# Altium project M3 ICE.PrjPcb
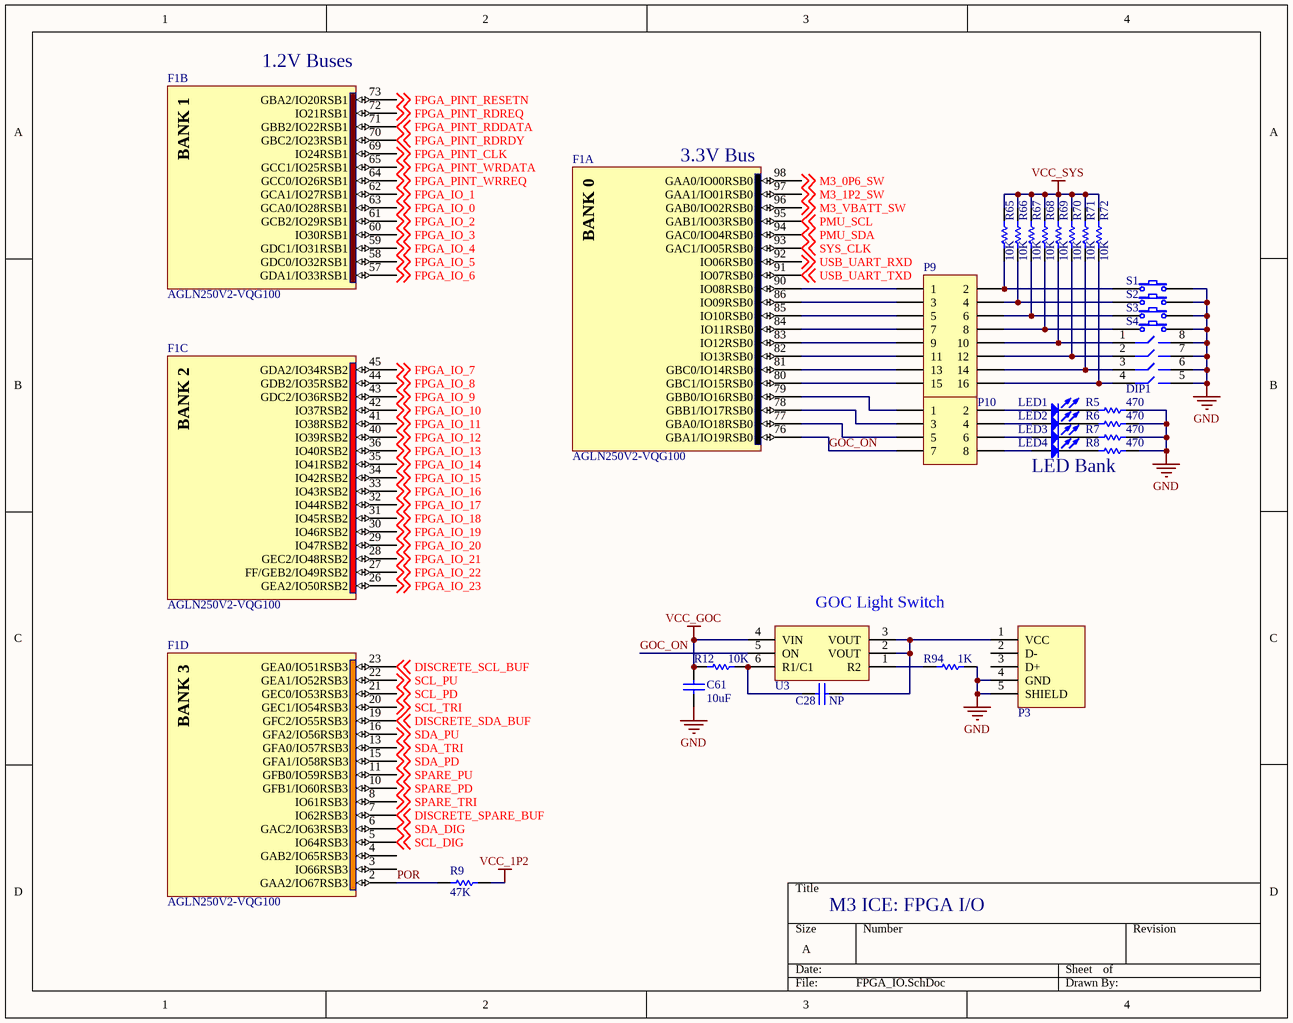
[diagram p0: FPGA_IO.SchDoc]
4 sheets, 185 parts. Net scope: global (net labels, ports and power ports of the same name join across sheets).
Board files: M3 ICE.PcbDoc, Drill Guide.PcbDoc
Sheets:
  FPGA_IO.SchDoc
  Power.SchDoc
  M3_Chip.SchDoc
  M3_Discrete_Interface.SchDoc

## Sheet FPGA_IO.SchDoc
size A

### Parts
C28  value NP  [0402]  (hidden comment: Cap Semi)
C61  value 10uF  [0805]  (hidden comment: Cap Chip)
DIP1  ADE0404  [DIP-8]  (value not drawn)
F1  AGLN250V2-VQG100  [VQ100_N]  (parts A,B,C,D of 8)
LED1  LED 1206  [1206_LED]  (value not drawn)
LED2  LED 1206  [1206_LED]  (value not drawn)
LED3  LED 1206  [1206_LED]  (value not drawn)
LED4  LED 1206  [1206_LED]  (value not drawn)
P3  USB_HORIZONTAL  [USB_HORIZONTAL]  (value not drawn)
P9  Header 8X2  [HDR2X8]  (value not drawn)
P10  Header 4X2  [HDR2X4]  (value not drawn)
R5  value 470  [0603]  (hidden comment: Res Chip)
R6  value 470  [0603]  (hidden comment: Res Chip)
R7  value 470  [0603]  (hidden comment: Res Chip)
R8  value 470  [0603]  (hidden comment: Res Chip)
R9  value 47K  [0603]  (hidden comment: Res Chip)
R12  value 10K  [0402]  (hidden comment: Res Chip)
R65  value 10K  [0603]  (hidden comment: Res Chip)
R66  value 10K  [0603]  (hidden comment: Res Chip)
R67  value 10K  [0603]  (hidden comment: Res Chip)
R68  value 10K  [0603]  (hidden comment: Res Chip)
R69  value 10K  [0603]  (hidden comment: Res Chip)
R70  value 10K  [0603]  (hidden comment: Res Chip)
R71  value 10K  [0603]  (hidden comment: Res Chip)
R72  value 10K  [0603]  (hidden comment: Res Chip)
R94  value 1K  [0402]  (hidden comment: Res Chip)
S1  EVQ-PAE04M  [EVQPA]  (value not drawn)
S2  EVQ-PAE04M  [EVQPA]  (value not drawn)
S3  EVQ-PAE04M  [EVQPA]  (value not drawn)
S4  EVQ-PAE04M  [EVQPA]  (value not drawn)
U3  FDC6330L  [SUPERSOT-6]  (value not drawn)

### Nets
GND: C61.2 DIP1.5 DIP1.6 DIP1.7 DIP1.8 P3.4(GND) P3.5(SHIELD) R5.1 R6.1 R7.1 R8.1 R94.2 S1.2 S2.2 S3.2 S4.2
VCC_1P2: R9.2
VCC_GOC: C61.1 R12.1 U3.4(VIN)
VCC_SYS: R65.1 R66.1 R67.1 R68.1 R69.1 R70.1 R71.1 R72.1
DISCRETE_SCL_BUF: F1.23(GEA0/IO51RSB3) ; off-sheet DISCRETE_SCL_BUF
DISCRETE_SDA_BUF: F1.19(GFC2/IO55RSB3) ; off-sheet DISCRETE_SDA_BUF
DISCRETE_SPARE_BUF: F1.7(IO62RSB3) ; off-sheet DISCRETE_SPARE_BUF
FPGA_IO_0: F1.63(GCA0/IO28RSB1) ; off-sheet FPGA_IO_0
FPGA_IO_1: F1.62(GCA1/IO27RSB1) ; off-sheet FPGA_IO_1
FPGA_IO_2: F1.61(GCB2/IO29RSB1) ; off-sheet FPGA_IO_2
FPGA_IO_3: F1.60(IO30RSB1) ; off-sheet FPGA_IO_3
FPGA_IO_4: F1.59(GDC1/IO31RSB1) ; off-sheet FPGA_IO_4
FPGA_IO_5: F1.58(GDC0/IO32RSB1) ; off-sheet FPGA_IO_5
FPGA_IO_6: F1.57(GDA1/IO33RSB1) ; off-sheet FPGA_IO_6
FPGA_IO_7: F1.45(GDA2/IO34RSB2) ; off-sheet FPGA_IO_7
FPGA_IO_8: F1.44(GDB2/IO35RSB2) ; off-sheet FPGA_IO_8
FPGA_IO_9: F1.43(GDC2/IO36RSB2) ; off-sheet FPGA_IO_9
FPGA_IO_10: F1.42(IO37RSB2) ; off-sheet FPGA_IO_10
FPGA_IO_11: F1.41(IO38RSB2) ; off-sheet FPGA_IO_11
FPGA_IO_12: F1.40(IO39RSB2) ; off-sheet FPGA_IO_12
FPGA_IO_13: F1.36(IO40RSB2) ; off-sheet FPGA_IO_13
FPGA_IO_14: F1.35(IO41RSB2) ; off-sheet FPGA_IO_14
FPGA_IO_15: F1.34(IO42RSB2) ; off-sheet FPGA_IO_15
FPGA_IO_16: F1.33(IO43RSB2) ; off-sheet FPGA_IO_16
FPGA_IO_17: F1.32(IO44RSB2) ; off-sheet FPGA_IO_17
FPGA_IO_18: F1.31(IO45RSB2) ; off-sheet FPGA_IO_18
FPGA_IO_19: F1.30(IO46RSB2) ; off-sheet FPGA_IO_19
FPGA_IO_20: F1.29(IO47RSB2) ; off-sheet FPGA_IO_20
FPGA_IO_21: F1.28(GEC2/IO48RSB2) ; off-sheet FPGA_IO_21
FPGA_IO_22: F1.27(FF/GEB2/IO49RSB2) ; off-sheet FPGA_IO_22
FPGA_IO_23: F1.26(GEA2/IO50RSB2) ; off-sheet FPGA_IO_23
FPGA_PINT_CLK: F1.69(IO24RSB1) ; off-sheet FPGA_PINT_CLK
FPGA_PINT_RDDATA: F1.71(GBB2/IO22RSB1) ; off-sheet FPGA_PINT_RDDATA
FPGA_PINT_RDRDY: F1.70(GBC2/IO23RSB1) ; off-sheet FPGA_PINT_RDRDY
FPGA_PINT_RDREQ: F1.72(IO21RSB1) ; off-sheet FPGA_PINT_RDREQ
FPGA_PINT_RESETN: F1.73(GBA2/IO20RSB1) ; off-sheet FPGA_PINT_RESETN
FPGA_PINT_WRDATA: F1.65(GCC1/IO25RSB1) ; off-sheet FPGA_PINT_WRDATA
FPGA_PINT_WRREQ: F1.64(GCC0/IO26RSB1) ; off-sheet FPGA_PINT_WRREQ
GOC_ON: F1.76(GBA1/IO19RSB0) P10.7 U3.5(ON)
M3_0P6_SW: F1.98(GAA0/IO00RSB0) ; off-sheet M3_0P6_SW
M3_1P2_SW: F1.97(GAA1/IO01RSB0) ; off-sheet M3_1P2_SW
M3_VBATT_SW: F1.96(GAB0/IO02RSB0) ; off-sheet M3_VBATT_SW
PMU_SCL: F1.95(GAB1/IO03RSB0) ; off-sheet PMU_SCL
PMU_SDA: F1.94(GAC0/IO04RSB0) ; off-sheet PMU_SDA
POR: F1.2(GAA2/IO67RSB3) R9.1
SCL_DIG: F1.5(IO64RSB3) ; off-sheet SCL_DIG
SCL_PD: F1.21(GEC0/IO53RSB3) ; off-sheet SCL_PD
SCL_PU: F1.22(GEA1/IO52RSB3) ; off-sheet SCL_PU
SCL_TRI: F1.20(GEC1/IO54RSB3) ; off-sheet SCL_TRI
SDA_DIG: F1.6(GAC2/IO63RSB3) ; off-sheet SDA_DIG
SDA_PD: F1.15(GFA1/IO58RSB3) ; off-sheet SDA_PD
SDA_PU: F1.16(GFA2/IO56RSB3) ; off-sheet SDA_PU
SDA_TRI: F1.13(GFA0/IO57RSB3) ; off-sheet SDA_TRI
SPARE_PD: F1.10(GFB1/IO60RSB3) ; off-sheet SPARE_PD
SPARE_PU: F1.11(GFB0/IO59RSB3) ; off-sheet SPARE_PU
SPARE_TRI: F1.8(IO61RSB3) ; off-sheet SPARE_TRI
SYS_CLK: F1.93(GAC1/IO05RSB0) ; off-sheet SYS_CLK
USB_UART_RXD: F1.92(IO06RSB0) ; off-sheet USB_UART_RXD
USB_UART_TXD: F1.91(IO07RSB0) ; off-sheet USB_UART_TXD
NetC28_1: C28.1 P3.1(VCC) U3.2(VOUT) U3.3(VOUT)
NetC28_2: C28.2 R12.2 U3.6(R1/C1)
NetDIP1_1: DIP1.1 P9.10 R69.2
NetDIP1_2: DIP1.2 P9.12 R70.2
NetDIP1_3: DIP1.3 P9.14 R71.2
NetDIP1_4: DIP1.4 P9.16 R72.2
NetF1_77: F1.77(GBA0/IO18RSB0) P10.5
NetF1_78: F1.78(GBB1/IO17RSB0) P10.3
NetF1_79: F1.79(GBB0/IO16RSB0) P10.1
NetF1_80: F1.80(GBC1/IO15RSB0) P9.15
NetF1_81: F1.81(GBC0/IO14RSB0) P9.13
NetF1_82: F1.82(IO13RSB0) P9.11
NetF1_83: F1.83(IO12RSB0) P9.9
NetF1_84: F1.84(IO11RSB0) P9.7
NetF1_85: F1.85(IO10RSB0) P9.5
NetF1_86: F1.86(IO09RSB0) P9.3
NetF1_90: F1.90(IO08RSB0) P9.1
NetLED1_1: LED1.1(A) P10.2
NetLED1_2: LED1.2(K) R5.2
NetLED2_1: LED2.1(A) P10.4
NetLED2_2: LED2.2(K) R6.2
NetLED3_1: LED3.1(A) P10.6
NetLED3_2: LED3.2(K) R7.2
NetLED4_1: LED4.1(A) P10.8
NetLED4_2: LED4.2(K) R8.2
NetP9_2: P9.2 R65.2 S1.1
NetP9_4: P9.4 R66.2 S2.1
NetP9_6: P9.6 R67.2 S3.1
NetP9_8: P9.8 R68.2 S4.1
NetR94_1: R94.1 U3.1(R2)

Not connected (* = marked no-connect by the designer): F1 3(IO66RSB3) 4(GAB2/IO65RSB3); P3 2(D-) 3(D+)

### Notes on the sheet
- (near F1) 1.2V Buses
- (near F1) 3.3V Bus
- LED Bank
- (near U3) GOC Light Switch
- M3 ICE: FPGA I/O
- (in symbol AGLN250V2-VQG100, part A) BANK 0
- (in symbol AGLN250V2-VQG100, part B) BANK 1
- (in symbol AGLN250V2-VQG100, part C) BANK 2
- (in symbol AGLN250V2-VQG100, part D) BANK 3

### Library data of the parts
C28 = Cap Semi: Capacitor (Semiconductor SIM Model); Published: 8-Jun-2000; LatestRevisionDate: 29-May-2009; LatestRevisionNote: IPC-7351 Footprint Added.; PackageReference: C1206; Publisher: Altium Limited; PackageDescription: Chip Capacitor
C61 = Cap Chip: Capacitor (Semiconductor SIM Model); DistPartNo: 445-6857-1-ND; ManPartNo: C2012X7R1A106K; Published: 8-Jun-2000; LatestRevisionDate: 29-May-2009; LatestRevisionNote: IPC-7351 Footprint Added.; PackageReference: C1206; Publisher: Altium Limited; PackageDescription: Chip Capacitor
DIP1 = ADE0404: 4-DIP Switch; DistPartNo: 450-1364-ND; PackageReference: DIP-8; ManPartNo: ADE0404
F1 = AGLN250V2-VQG100: IGLOO nano Low-Power Flash 1.2 to 1.5V FPGA with Flash*Freeze, 68 User IOs, 250K System Gates, 1Kbit Flash ROM, 100-Pin TQFP, Commercial Grade, Pb-Free; DistPartNo: 1100-1134-ND; Published: 29-May-2009; DatasheetVersion: Feb-2009; PackageVersion: v11.0, Feb-2009; PackageReference: VQ100; Publisher: Altium Limited; PackageDescription: 100-Pin Plastic Quad Flat Pack (VQ100); Code_JEDEC: MS-026-AED; ComponentLink1Description: Manufacturer Link; ComponentLink1URL: http://www.actel.com/products/igloonano/default.aspx; ComponentLink2Description: Datasheet; ComponentLink2URL: http://www.actel.com/documents/IGLOO_nano_DS.pdf; ManPartNo: AGLN250V2-VQG100
LED1-LED4 = LED 1206: DistPartNo: 160-1169-1-ND; ManPartNo: LTST-C150GKT
P3 = USB_HORIZONTAL: DistPartNo: A31726-ND; ManPartNo: 292303-1
P9 = Header 8X2: Header, 8-Pin, Dual row; LatestRevisionDate: 17-Jul-2002; LatestRevisionNote: Re-released for DXP Platform.; Publisher: Altium Limited
P10 = Header 4X2: Header, 4-Pin, Dual row; LatestRevisionDate: 17-Jul-2002; LatestRevisionNote: Re-released for DXP Platform.; Publisher: Altium Limited
R5-R8 = Res Chip: Semiconductor Resistor; DistPartNo: P470GCT-ND; ManPartNo: ERJ-3GEYJ471V; Published: 8-Jun-2000; LatestRevisionDate: 17-Jul-2002; LatestRevisionNote: Re-released for DXP Platform.; PackageReference: AXIAL-0.5; Publisher: Altium Limited; PackageDescription: Axial Device, Thru-Hole; 2 Leads; 0.5 in Pin Spacing
R9 = Res Chip: Semiconductor Resistor; DistPartNo: P47KGCT-ND; ManPartNo: ERJ-3GEYJ103V; Published: 8-Jun-2000; LatestRevisionDate: 17-Jul-2002; LatestRevisionNote: Re-released for DXP Platform.; PackageReference: AXIAL-0.5; Publisher: Altium Limited; PackageDescription: Axial Device, Thru-Hole; 2 Leads; 0.5 in Pin Spacing
R12 = Res Chip: Semiconductor Resistor; ManPartNo: ERJ-2RKF1002X; DistPartNo: P10.0KLCT-ND; Published: 8-Jun-2000; LatestRevisionDate: 17-Jul-2002; LatestRevisionNote: Re-released for DXP Platform.; PackageReference: AXIAL-0.5; Publisher: Altium Limited; PackageDescription: Axial Device, Thru-Hole; 2 Leads; 0.5 in Pin Spacing
R65-R72 = Res Chip: Semiconductor Resistor; DistPartNo: P10KGCT-ND; ManPartNo: ERJ-3GEYJ103V; Published: 8-Jun-2000; LatestRevisionDate: 17-Jul-2002; LatestRevisionNote: Re-released for DXP Platform.; PackageReference: AXIAL-0.5; Publisher: Altium Limited; PackageDescription: Axial Device, Thru-Hole; 2 Leads; 0.5 in Pin Spacing
R94 = Res Chip: Semiconductor Resistor; ManPartNo: ERJ-2RKF1001X; DistPartNo: P1.00KLCT-ND; Published: 8-Jun-2000; LatestRevisionDate: 17-Jul-2002; LatestRevisionNote: Re-released for DXP Platform.; PackageReference: AXIAL-0.5; Publisher: Altium Limited; PackageDescription: Axial Device, Thru-Hole; 2 Leads; 0.5 in Pin Spacing
S1-S4 = EVQ-PAE04M: Switch Push; DistPartNo: P8008S-ND; ManPartNo: EVQ-PAE04M
U3 = FDC6330L: HS Switch; DistPartNo: FDC6330LCT-ND; ManPartNo: FDC6330L

## Sheet Power.SchDoc
size A
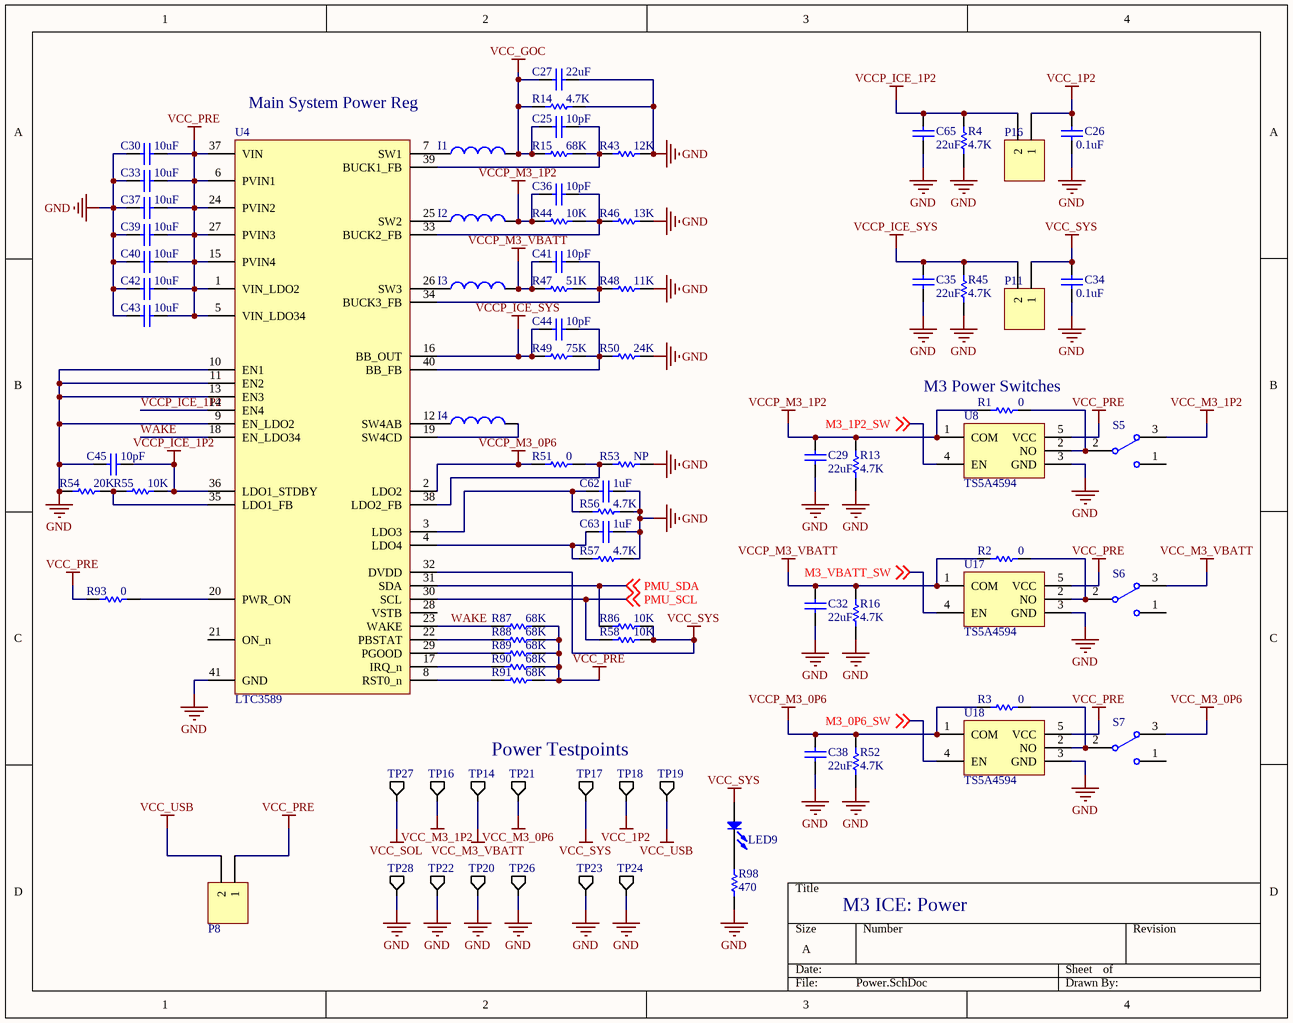
[diagram p1: Power.SchDoc]

### Parts
C25  value 10pF  [0402]  (hidden comment: Cap Semi)
C26  value 0.1uF  [1608[0603]]  (hidden comment: Cap Semi)
C27  value 22uF  [0805]  (hidden comment: Cap Chip)
C29  value 22uF  [0805]  (hidden comment: Cap Chip)
C30  value 10uF  [0805]  (hidden comment: Cap Chip)
C32  value 22uF  [0805]  (hidden comment: Cap Chip)
C33  value 10uF  [0805]  (hidden comment: Cap Chip)
C34  value 0.1uF  [1608[0603]]  (hidden comment: Cap Semi)
C35  value 22uF  [0805]  (hidden comment: Cap Chip)
C36  value 10pF  [0402]  (hidden comment: Cap Semi)
C37  value 10uF  [0805]  (hidden comment: Cap Chip)
C38  value 22uF  [0805]  (hidden comment: Cap Chip)
C39  value 10uF  [0805]  (hidden comment: Cap Chip)
C40  value 10uF  [0805]  (hidden comment: Cap Chip)
C41  value 10pF  [0402]  (hidden comment: Cap Semi)
C42  value 10uF  [0805]  (hidden comment: Cap Chip)
C43  value 10uF  [0805]  (hidden comment: Cap Chip)
C44  value 10pF  [0402]  (hidden comment: Cap Semi)
C45  value 10pF  [0402]  (hidden comment: Cap Semi)
C62  value 1uF  [0402]  (hidden comment: Cap Semi)
C63  value 1uF  [0402]  (hidden comment: Cap Semi)
C65  value 22uF  [0805]  (hidden comment: Cap Chip)
I1  NR5040T1R5N  [INDUCTOR_.118x.142mm]  (value not drawn)
I2  NR5040T1R5N  [INDUCTOR_.118x.142mm]  (value not drawn)
I3  NR5040T1R5N  [INDUCTOR_.118x.142mm]  (value not drawn)
I4  NR5040T1R5N  [INDUCTOR_.118x.142mm]  (value not drawn)
LED9  LED 1206  [1206_LED]  (value not drawn)
P8  Header 2  [HDR1X2]  (value not drawn)
P11  Header 2  [HDR1X2]  (value not drawn)
P16  Header 2  [HDR1X2]  (value not drawn)
R1  value 0  [0603]  (hidden comment: Res Chip)
R2  value 0  [0603]  (hidden comment: Res Chip)
R3  value 0  [0603]  (hidden comment: Res Chip)
R4  value 4.7K  [0603]  (hidden comment: Res Chip)
R13  value 4.7K  [0603]  (hidden comment: Res Chip)
R14  value 4.7K  [0603]  (hidden comment: Res Chip)
R15  value 68K  [0402]  (hidden comment: Res Chip)
R16  value 4.7K  [0603]  (hidden comment: Res Chip)
R43  value 12K  [0402]  (hidden comment: Res Chip)
R44  value 10K  [0402]  (hidden comment: Res Chip)
R45  value 4.7K  [0603]  (hidden comment: Res Chip)
R46  value 13K  [0402]  (hidden comment: Res Chip)
R47  value 51K  [0402]  (hidden comment: Res Chip)
R48  value 11K  [0402]  (hidden comment: Res Chip)
R49  value 75K  [0402]  (hidden comment: Res Chip)
R50  value 24K  [0402]  (hidden comment: Res Chip)
R51  value 0  [0402]  (hidden comment: Res Chip)
R52  value 4.7K  [0603]  (hidden comment: Res Chip)
R53  value NP  [0402]  (hidden comment: Res Chip)
R54  value 20K  [0402]  (hidden comment: Res Chip)
R55  value 10K  [0402]  (hidden comment: Res Chip)
R56  value 4.7K  [0402]  (hidden comment: Res Chip)
R57  value 4.7K  [0402]  (hidden comment: Res Chip)
R58  value 10K  [0402]  (hidden comment: Res Chip)
R86  value 10K  [0402]  (hidden comment: Res Chip)
R87  value 68K  [0402]  (hidden comment: Res Chip)
R88  value 68K  [0402]  (hidden comment: Res Chip)
R89  value 68K  [0402]  (hidden comment: Res Chip)
R90  value 68K  [0402]  (hidden comment: Res Chip)
R91  value 68K  [0402]  (hidden comment: Res Chip)
R93  value 0  [0402]  (hidden comment: Res Chip)
R98  value 470  [0603]  (hidden comment: Res Chip)
S5  OS102011MS2QN1  [SPDT_SW2]  (value not drawn)
S6  OS102011MS2QN1  [SPDT_SW2]  (value not drawn)
S7  OS102011MS2QN1  [SPDT_SW2]  (value not drawn)
TP14  TP  [TP]  (value not drawn)
TP16  TP  [TP]  (value not drawn)
TP17  TP  [TP]  (value not drawn)
TP18  TP  [TP]  (value not drawn)
TP19  TP  [TP]  (value not drawn)
TP20  TP  [TP]  (value not drawn)
TP21  TP  [TP]  (value not drawn)
TP22  TP  [TP]  (value not drawn)
TP23  TP  [TP]  (value not drawn)
TP24  TP  [TP]  (value not drawn)
TP26  TP  [TP]  (value not drawn)
TP27  TP  [TP]  (value not drawn)
TP28  TP  [TP]  (value not drawn)
U4  LTC3589  [QFN-40]
U8  TS5A4594  [SOT25]
U17  TS5A4594  [SOT25]
U18  TS5A4594  [SOT25]

### Nets
GND: C26.1 C27.1 C29.1 C30.2 C32.1 C33.2 C34.1 C35.1 C37.2 C38.1 C39.2 C40.2 C42.2 C43.2 C45.2 C62.1 C63.1 C65.2 R4.2 R13.1 R14.1 R16.1 R43.2 R45.1 R46.2 R48.2 R50.2 R52.1 R53.2 R54.1 R56.2 R57.2 R98.1 TP20.1(A) TP22.1(A) TP23.1(A) TP24.1(A) TP26.1(A) TP28.1(A) U4.9(EN_LDO2) U4.10(EN1) U4.11(EN2) U4.13(EN3) U4.41(GND) U8.3(GND) U17.3(GND) U18.3(GND)
VCC_1P2: C26.2 P16.1 TP18.1(A)
VCC_GOC: C25.2 C27.2 I1.2 R14.2 R15.1
VCC_M3_0P6: S7.3 TP21.1(A)
VCC_M3_1P2: S5.3 TP16.1(A)
VCC_M3_VBATT: S6.3 TP14.1(A)
VCC_PRE: C30.1 C33.1 C37.1 C39.1 C40.1 C42.1 C43.1 P8.1 R87.2 R88.2 R89.2 R90.2 R91.2 R93.1 U4.1(VIN_LDO2) U4.5(VIN_LDO34) U4.6(PVIN1) U4.15(PVIN4) U4.24(PVIN2) U4.27(PVIN3) U4.37(VIN) U8.5(VCC) U17.5(VCC) U18.5(VCC)
VCC_SOL: TP27.1(A)
VCC_SYS: C34.2 LED9.1(A) P11.1 R58.2 R86.2 TP17.1(A) U4.32(DVDD)
VCC_USB: P8.2 TP19.1(A)
VCCP_ICE_1P2: C45.1 C65.1 P16.2 R4.1 R55.2 U4.14(EN4) U4.36(LDO1_STDBY)
VCCP_ICE_SYS: C35.2 C44.2 P11.2 R45.2 R49.1 U4.16(BB_OUT)
VCCP_M3_0P6: C38.2 R3.2 R51.1 R52.2 U4.2(LDO2) U18.1(COM)
VCCP_M3_1P2: C29.2 C36.2 I2.2 R1.2 R13.2 R44.1 U8.1(COM)
VCCP_M3_VBATT: C32.2 C41.2 I3.2 R2.2 R16.2 R47.1 U17.1(COM)
M3_0P6_SW: U18.4(EN) ; off-sheet M3_0P6_SW
M3_1P2_SW: U8.4(EN) ; off-sheet M3_1P2_SW
M3_VBATT_SW: U17.4(EN) ; off-sheet M3_VBATT_SW
PMU_SCL: R58.1 U4.30(SCL) ; off-sheet PMU_SCL
PMU_SDA: R86.1 U4.31(SDA) ; off-sheet PMU_SDA
WAKE: R87.1 U4.18(EN_LDO34) U4.23(WAKE)
NetC25_1: C25.1 R15.2 R43.1 U4.39(BUCK1_FB)
NetC36_1: C36.1 R44.2 R46.1 U4.33(BUCK2_FB)
NetC41_1: C41.1 R47.2 R48.1 U4.34(BUCK3_FB)
NetC44_1: C44.1 R49.2 R50.1 U4.40(BB_FB)
NetC62_2: C62.2 R56.1 U4.3(LDO3)
NetC63_2: C63.2 R57.1 U4.4(LDO4)
NetI1_1: I1.1 U4.7(SW1)
NetI2_1: I2.1 U4.25(SW2)
NetI3_1: I3.1 U4.26(SW3)
NetI4_1: I4.1 U4.12(SW4AB)
NetI4_2: I4.2 U4.19(SW4CD)
NetLED9_2: LED9.2(K) R98.2
NetR1_1: R1.1 S5.2 U8.2(NO)
NetR2_1: R2.1 S6.2 U17.2(NO)
NetR3_1: R3.1 S7.2 U18.2(NO)
NetR51_2: R51.2 R53.1 U4.38(LDO2_FB)
NetR54_2: R54.2 R55.1 U4.35(LDO1_FB)
NetR88_1: R88.1 U4.22(PBSTAT)
NetR89_1: R89.1 U4.29(PGOOD)
NetR90_1: R90.1 U4.17(IRQ_n)
NetR91_1: R91.1 U4.8(RST0_n)
NetR93_2: R93.2 U4.20(PWR_ON)

Not connected (* = marked no-connect by the designer): S5 1; S6 1; S7 1; U4 21(ON_n) 28(VSTB)

### Notes on the sheet
- Main System Power Reg
- (near R1) M3 Power Switches
- Power Testpoints
- M3 ICE: Power

### Library data of the parts
C25 C36 C41 C44 C45 = Cap Semi: Capacitor (Semiconductor SIM Model); DistPartNo: 445-1235-1-ND; ManPartNo: C1005C0G1H100D; Published: 8-Jun-2000; LatestRevisionDate: 29-May-2009; LatestRevisionNote: IPC-7351 Footprint Added.; PackageReference: C1206; Publisher: Altium Limited; PackageDescription: Chip Capacitor
C26 C34 = Cap Semi: Capacitor (Semiconductor SIM Model); DistPartNo: 445-1317-1-ND; ManPartNo: C1608X7R1C104K; Published: 8-Jun-2000; LatestRevisionDate: 29-May-2009; LatestRevisionNote: IPC-7351 Footprint Added.; PackageReference: C1206; Publisher: Altium Limited; PackageDescription: Chip Capacitor
C27 C29 C32 C35 C38 C65 = Cap Chip: Capacitor (Semiconductor SIM Model); DistPartNo: 587-2782-1-ND; ManPartNo: LMK316AB7226ML-TR; Published: 8-Jun-2000; LatestRevisionDate: 29-May-2009; LatestRevisionNote: IPC-7351 Footprint Added.; PackageReference: C1206; Publisher: Altium Limited; PackageDescription: Chip Capacitor
C30 C33 C37 C39 C40 C42 C43 = Cap Chip: as C61 on sheet FPGA_IO; Published: 8-Jun-2000; LatestRevisionDate: 29-May-2009; LatestRevisionNote: IPC-7351 Footprint Added.; PackageReference: C1206; Publisher: Altium Limited; PackageDescription: Chip Capacitor
C62 C63 = Cap Semi: Capacitor (Semiconductor SIM Model); DistPartNo: 445-4991-1-ND; ManPartNo: C1005X5R1A105M; Published: 8-Jun-2000; LatestRevisionDate: 29-May-2009; LatestRevisionNote: IPC-7351 Footprint Added.; PackageReference: C1206; Publisher: Altium Limited; PackageDescription: Chip Capacitor
I1-I4 = IHLP1212: DistPartNo: 541-1327-1-ND; ManPartNo: IHLP1212AEER1R0M11
LED9 = LED 1206: as LED1 on sheet FPGA_IO
P8 P11 P16 = Header 2: Header, 2-Pin; LatestRevisionDate: 17-Jul-2002; LatestRevisionNote: Re-released for DXP Platform.; Publisher: Altium Limited
R1-R3 = Res Chip: Semiconductor Resistor; DistPartNo: P0.0GCT-ND; ManPartNo: ERJ-3GEY0R00V; Published: 8-Jun-2000; LatestRevisionDate: 17-Jul-2002; LatestRevisionNote: Re-released for DXP Platform.; PackageReference: AXIAL-0.5; Publisher: Altium Limited; PackageDescription: Axial Device, Thru-Hole; 2 Leads; 0.5 in Pin Spacing
R4 R13 R14 R16 R45 R52 = Res Chip: Semiconductor Resistor; DistPartNo: P4.7KGCT-ND; ManPartNo: ERJ-3GEYJ472V; Published: 8-Jun-2000; LatestRevisionDate: 17-Jul-2002; LatestRevisionNote: Re-released for DXP Platform.; PackageReference: AXIAL-0.5; Publisher: Altium Limited; PackageDescription: Axial Device, Thru-Hole; 2 Leads; 0.5 in Pin Spacing
R15 R87-R91 = Res Chip: Semiconductor Resistor; DistPartNo: P68.0KLCT-ND; ManPartNo: ERJ-2RKF6802X; Published: 8-Jun-2000; LatestRevisionDate: 17-Jul-2002; LatestRevisionNote: Re-released for DXP Platform.; PackageReference: AXIAL-0.5; Publisher: Altium Limited; PackageDescription: Axial Device, Thru-Hole; 2 Leads; 0.5 in Pin Spacing
R43 = Res Chip: Semiconductor Resistor; DistPartNo: P12.0KLCT-ND; ManPartNo: ERJ-2RKF1202X; Published: 8-Jun-2000; LatestRevisionDate: 17-Jul-2002; LatestRevisionNote: Re-released for DXP Platform.; PackageReference: AXIAL-0.5; Publisher: Altium Limited; PackageDescription: Axial Device, Thru-Hole; 2 Leads; 0.5 in Pin Spacing
R44 R55 R58 R86 = Res Chip: Semiconductor Resistor; DistPartNo: P10.0KLCT-ND; ManPartNo: ERJ-2RKF1002X; Published: 8-Jun-2000; LatestRevisionDate: 17-Jul-2002; LatestRevisionNote: Re-released for DXP Platform.; PackageReference: AXIAL-0.5; Publisher: Altium Limited; PackageDescription: Axial Device, Thru-Hole; 2 Leads; 0.5 in Pin Spacing
R46 = Res Chip: Semiconductor Resistor; DistPartNo: 311-13.0KLRCT-ND; ManPartNo: RC0402FR-0713KL; Published: 8-Jun-2000; LatestRevisionDate: 17-Jul-2002; LatestRevisionNote: Re-released for DXP Platform.; PackageReference: AXIAL-0.5; Publisher: Altium Limited; PackageDescription: Axial Device, Thru-Hole; 2 Leads; 0.5 in Pin Spacing
R47 = Res Chip: Semiconductor Resistor; DistPartNo: P51.0KLCT-ND; ManPartNo: ERJ-2RKF5102X; Published: 8-Jun-2000; LatestRevisionDate: 17-Jul-2002; LatestRevisionNote: Re-released for DXP Platform.; PackageReference: AXIAL-0.5; Publisher: Altium Limited; PackageDescription: Axial Device, Thru-Hole; 2 Leads; 0.5 in Pin Spacing
R48 = Res Chip: Semiconductor Resistor; DistPartNo: P11.0KLCT-ND; ManPartNo: ERJ-2RKF1102X; Published: 8-Jun-2000; LatestRevisionDate: 17-Jul-2002; LatestRevisionNote: Re-released for DXP Platform.; PackageReference: AXIAL-0.5; Publisher: Altium Limited; PackageDescription: Axial Device, Thru-Hole; 2 Leads; 0.5 in Pin Spacing
R49 = Res Chip: Semiconductor Resistor; DistPartNo: P75.0KLCT-ND; ManPartNo: ERJ-2RKF7502X; Published: 8-Jun-2000; LatestRevisionDate: 17-Jul-2002; LatestRevisionNote: Re-released for DXP Platform.; PackageReference: AXIAL-0.5; Publisher: Altium Limited; PackageDescription: Axial Device, Thru-Hole; 2 Leads; 0.5 in Pin Spacing
R50 = Res Chip: Semiconductor Resistor; DistPartNo: RMCF0402FT24K0CT-ND; ManPartNo: RMCF0402FT24K0; Published: 8-Jun-2000; LatestRevisionDate: 17-Jul-2002; LatestRevisionNote: Re-released for DXP Platform.; PackageReference: AXIAL-0.5; Publisher: Altium Limited; PackageDescription: Axial Device, Thru-Hole; 2 Leads; 0.5 in Pin Spacing
R51 R93 = Res Chip: Semiconductor Resistor; DistPartNo: P0.0JCT-ND; ManPartNo: ERJ-2GE0R00X; Published: 8-Jun-2000; LatestRevisionDate: 17-Jul-2002; LatestRevisionNote: Re-released for DXP Platform.; PackageReference: AXIAL-0.5; Publisher: Altium Limited; PackageDescription: Axial Device, Thru-Hole; 2 Leads; 0.5 in Pin Spacing
R53 = Res Chip: Semiconductor Resistor; Published: 8-Jun-2000; LatestRevisionDate: 17-Jul-2002; LatestRevisionNote: Re-released for DXP Platform.; PackageReference: AXIAL-0.5; Publisher: Altium Limited; PackageDescription: Axial Device, Thru-Hole; 2 Leads; 0.5 in Pin Spacing
R54 = Res Chip: Semiconductor Resistor; DistPartNo: P20.0KLCT-ND; ManPartNo: ERJ-2RKF2002X; Published: 8-Jun-2000; LatestRevisionDate: 17-Jul-2002; LatestRevisionNote: Re-released for DXP Platform.; PackageReference: AXIAL-0.5; Publisher: Altium Limited; PackageDescription: Axial Device, Thru-Hole; 2 Leads; 0.5 in Pin Spacing
R56 R57 = Res Chip: Semiconductor Resistor; DistPartNo: P4.70KLCT-ND; ManPartNo: ERJ-2RKF4701X; Published: 8-Jun-2000; LatestRevisionDate: 17-Jul-2002; LatestRevisionNote: Re-released for DXP Platform.; PackageReference: AXIAL-0.5; Publisher: Altium Limited; PackageDescription: Axial Device, Thru-Hole; 2 Leads; 0.5 in Pin Spacing
R98 = Res Chip: as R5 on sheet FPGA_IO; Published: 8-Jun-2000; LatestRevisionDate: 17-Jul-2002; LatestRevisionNote: Re-released for DXP Platform.; PackageReference: AXIAL-0.5; Publisher: Altium Limited; PackageDescription: Axial Device, Thru-Hole; 2 Leads; 0.5 in Pin Spacing
S5-S7 = OS102011MS2QN1: SPDT Slide Switch; DistPartNo: CKN9565-ND; ManPartNo: OS102011MS2QN1
U4 = LTC3589: DistPartNo: LTC3589EUJ-2#PBF-ND; ManPartNo: LTC3589EUJ-2#PBF
U8 U17 U18 = TS5A4594: SPST Analog Switch; DistPartNo: 296-17705-1-ND; ManPartNo: TS5A4594DBVR

## Sheet M3_Chip.SchDoc
size A
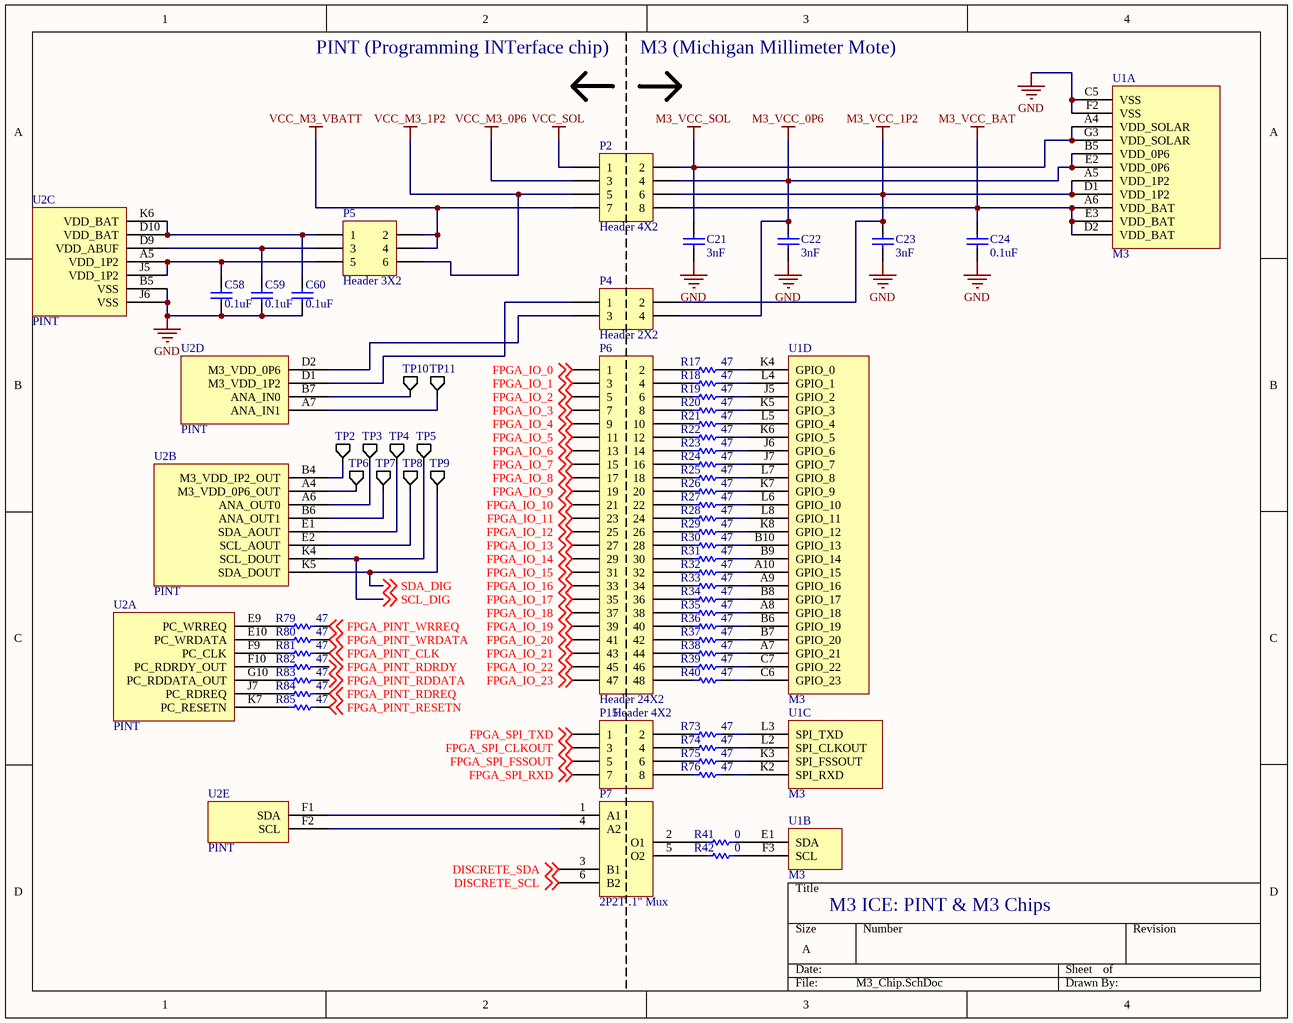
[diagram p2: M3_Chip.SchDoc]

### Parts
C21  value 3nF  [1608[0603]]  (hidden comment: Cap Semi)
C22  value 3nF  [1608[0603]]  (hidden comment: Cap Semi)
C23  value 3nF  [1608[0603]]  (hidden comment: Cap Semi)
C24  value 0.1uF  [1608[0603]]  (hidden comment: Cap Semi)
C58  value 0.1uF  [1608[0603]]  (hidden comment: Cap Semi)
C59  value 0.1uF  [1608[0603]]  (hidden comment: Cap Semi)
C60  value 0.1uF  [1608[0603]]  (hidden comment: Cap Semi)
P2  Header 4X2  [HDR2X4]
P4  Header 2X2  [HDR2X2]
P5  Header 3X2  [HDR2X3]
P6  Header 24X2  [HDR2X24]
P7  2P2T .1" Mux  [HDR3x2]
P15  Header 4X2  [HDR2X4]
R17  value 47  [0603]  (hidden comment: Res Chip)
R18  value 47  [0603]  (hidden comment: Res Chip)
R19  value 47  [0603]  (hidden comment: Res Chip)
R20  value 47  [0603]  (hidden comment: Res Chip)
R21  value 47  [0603]  (hidden comment: Res Chip)
R22  value 47  [0603]  (hidden comment: Res Chip)
R23  value 47  [0603]  (hidden comment: Res Chip)
R24  value 47  [0603]  (hidden comment: Res Chip)
R25  value 47  [0603]  (hidden comment: Res Chip)
R26  value 47  [0603]  (hidden comment: Res Chip)
R27  value 47  [0603]  (hidden comment: Res Chip)
R28  value 47  [0603]  (hidden comment: Res Chip)
R29  value 47  [0603]  (hidden comment: Res Chip)
R30  value 47  [0603]  (hidden comment: Res Chip)
R31  value 47  [0603]  (hidden comment: Res Chip)
R32  value 47  [0603]  (hidden comment: Res Chip)
R33  value 47  [0603]  (hidden comment: Res Chip)
R34  value 47  [0603]  (hidden comment: Res Chip)
R35  value 47  [0603]  (hidden comment: Res Chip)
R36  value 47  [0603]  (hidden comment: Res Chip)
R37  value 47  [0603]  (hidden comment: Res Chip)
R38  value 47  [0603]  (hidden comment: Res Chip)
R39  value 47  [0603]  (hidden comment: Res Chip)
R40  value 47  [0603]  (hidden comment: Res Chip)
R41  value 0  [0603]  (hidden comment: Res Chip)
R42  value 0  [0603]  (hidden comment: Res Chip)
R73  value 47  [0603]  (hidden comment: Res Chip)
R74  value 47  [0603]  (hidden comment: Res Chip)
R75  value 47  [0603]  (hidden comment: Res Chip)
R76  value 47  [0603]  (hidden comment: Res Chip)
R79  value 47  [0603]  (hidden comment: Res Chip)
R80  value 47  [0603]  (hidden comment: Res Chip)
R81  value 47  [0603]  (hidden comment: Res Chip)
R82  value 47  [0603]  (hidden comment: Res Chip)
R83  value 47  [0603]  (hidden comment: Res Chip)
R84  value 47  [0603]  (hidden comment: Res Chip)
R85  value 47  [0603]  (hidden comment: Res Chip)
TP2  TP  [TP]  (value not drawn)
TP3  TP  [TP]  (value not drawn)
TP4  TP  [TP]  (value not drawn)
TP5  TP  [TP]  (value not drawn)
TP6  TP  [TP]  (value not drawn)
TP7  TP  [TP]  (value not drawn)
TP8  TP  [TP]  (value not drawn)
TP9  TP  [TP]  (value not drawn)
TP10  TP  [TP]  (value not drawn)
TP11  TP  [TP]  (value not drawn)
U1  M3  [CPGA-84]  (parts A,B,C,D of 4)
U2  PINT  [CPGA-65]  (parts A,B,C,D,E of 5)

### Nets
GND: C21.1 C22.1 C23.1 C24.1 C58.1 C59.1 C60.1 U1.C5(VSS) U1.F2(VSS) U2.B5(VSS) U2.J6(VSS)
M3_VCC_0P6: C22.2 P2.4 P4.4 U1.B5(VDD_0P6) U1.E2(VDD_0P6)
M3_VCC_1P2: C23.2 P2.6 P4.2 U1.A5(VDD_1P2) U1.D1(VDD_1P2)
M3_VCC_BAT: C24.2 P2.8 U1.A6(VDD_BAT) U1.D2(VDD_BAT) U1.E3(VDD_BAT)
M3_VCC_SOL: C21.2 P2.2 U1.A4(VDD_SOLAR) U1.G3(VDD_SOLAR)
VCC_M3_0P6: P2.3
VCC_M3_1P2: P2.5 P5.6
VCC_M3_VBATT: P2.7 P5.2 P5.4
VCC_SOL: P2.1
DISCRETE_SCL: P7.6(B2) ; off-sheet DISCRETE_SCL
DISCRETE_SDA: P7.3(B1) ; off-sheet DISCRETE_SDA
FPGA_IO_0: P6.1 ; off-sheet FPGA_IO_0
FPGA_IO_1: P6.3 ; off-sheet FPGA_IO_1
FPGA_IO_2: P6.5 ; off-sheet FPGA_IO_2
FPGA_IO_3: P6.7 ; off-sheet FPGA_IO_3
FPGA_IO_4: P6.9 ; off-sheet FPGA_IO_4
FPGA_IO_5: P6.11 ; off-sheet FPGA_IO_5
FPGA_IO_6: P6.13 ; off-sheet FPGA_IO_6
FPGA_IO_7: P6.15 ; off-sheet FPGA_IO_7
FPGA_IO_8: P6.17 ; off-sheet FPGA_IO_8
FPGA_IO_9: P6.19 ; off-sheet FPGA_IO_9
FPGA_IO_10: P6.21 ; off-sheet FPGA_IO_10
FPGA_IO_11: P6.23 ; off-sheet FPGA_IO_11
FPGA_IO_12: P6.25 ; off-sheet FPGA_IO_12
FPGA_IO_13: P6.27 ; off-sheet FPGA_IO_13
FPGA_IO_14: P6.29 ; off-sheet FPGA_IO_14
FPGA_IO_15: P6.31 ; off-sheet FPGA_IO_15
FPGA_IO_16: P6.33 ; off-sheet FPGA_IO_16
FPGA_IO_17: P6.35 ; off-sheet FPGA_IO_17
FPGA_IO_18: P6.37 ; off-sheet FPGA_IO_18
FPGA_IO_19: P6.39 ; off-sheet FPGA_IO_19
FPGA_IO_20: P6.41 ; off-sheet FPGA_IO_20
FPGA_IO_21: P6.43 ; off-sheet FPGA_IO_21
FPGA_IO_22: P6.45 ; off-sheet FPGA_IO_22
FPGA_IO_23: P6.47 ; off-sheet FPGA_IO_23
FPGA_PINT_CLK: R81.1 ; off-sheet FPGA_PINT_CLK
FPGA_PINT_RDDATA: R83.1 ; off-sheet FPGA_PINT_RDDATA
FPGA_PINT_RDRDY: R82.1 ; off-sheet FPGA_PINT_RDRDY
FPGA_PINT_RDREQ: R84.1 ; off-sheet FPGA_PINT_RDREQ
FPGA_PINT_RESETN: R85.1 ; off-sheet FPGA_PINT_RESETN
FPGA_PINT_WRDATA: R80.1 ; off-sheet FPGA_PINT_WRDATA
FPGA_PINT_WRREQ: R79.1 ; off-sheet FPGA_PINT_WRREQ
FPGA_SPI_CLKOUT: P15.3 ; off-sheet FPGA_SPI_CLKOUT
FPGA_SPI_FSSOUT: P15.5 ; off-sheet FPGA_SPI_FSSOUT
FPGA_SPI_RXD: P15.7 ; off-sheet FPGA_SPI_RXD
FPGA_SPI_TXD: P15.1 ; off-sheet FPGA_SPI_TXD
SCL_DIG: TP5.1(A) U2.K4(SCL_DOUT) ; off-sheet SCL_DIG
SDA_DIG: TP9.1(A) U2.K5(SDA_DOUT) ; off-sheet SDA_DIG
NetC58_2: C58.2 P5.5 U2.A5(VDD_1P2) U2.J5(VDD_1P2)
NetC59_2: C59.2 P5.3 U2.D9(VDD_ABUF)
NetC60_2: C60.2 P5.1 U2.D10(VDD_BAT) U2.K6(VDD_BAT)
NetP4_1: P4.1 U2.D1(M3_VDD_1P2)
NetP4_3: P4.3 U2.D2(M3_VDD_0P6)
NetP6_2: P6.2 R17.2
NetP6_4: P6.4 R18.2
NetP6_6: P6.6 R19.2
NetP6_8: P6.8 R20.2
NetP6_10: P6.10 R21.2
NetP6_12: P6.12 R22.2
NetP6_14: P6.14 R23.2
NetP6_16: P6.16 R24.2
NetP6_18: P6.18 R25.2
NetP6_20: P6.20 R26.2
NetP6_22: P6.22 R27.2
NetP6_24: P6.24 R28.2
NetP6_26: P6.26 R29.2
NetP6_28: P6.28 R30.2
NetP6_30: P6.30 R31.2
NetP6_32: P6.32 R32.2
NetP6_34: P6.34 R33.2
NetP6_36: P6.36 R34.2
NetP6_38: P6.38 R35.2
NetP6_40: P6.40 R36.2
NetP6_42: P6.42 R37.2
NetP6_44: P6.44 R38.2
NetP6_46: P6.46 R39.2
NetP6_48: P6.48 R40.2
NetP7_1: P7.1(A1) U2.F1(SDA)
NetP7_2: P7.2(O1) R41.2
NetP7_4: P7.4(A2) U2.F2(SCL)
NetP7_5: P7.5(O2) R42.2
NetP15_2: P15.2 R73.2
NetP15_4: P15.4 R74.2
NetP15_6: P15.6 R75.2
NetP15_8: P15.8 R76.2
NetR17_1: R17.1 U1.K4(GPIO_0)
NetR18_1: R18.1 U1.L4(GPIO_1)
NetR19_1: R19.1 U1.J5(GPIO_2)
NetR20_1: R20.1 U1.K5(GPIO_3)
NetR21_1: R21.1 U1.L5(GPIO_4)
NetR22_1: R22.1 U1.K6(GPIO_5)
NetR23_1: R23.1 U1.J6(GPIO_6)
NetR24_1: R24.1 U1.J7(GPIO_7)
NetR25_1: R25.1 U1.L7(GPIO_8)
NetR26_1: R26.1 U1.K7(GPIO_9)
NetR27_1: R27.1 U1.L6(GPIO_10)
NetR28_1: R28.1 U1.L8(GPIO_11)
NetR29_1: R29.1 U1.K8(GPIO_12)
NetR30_1: R30.1 U1.B10(GPIO_13)
NetR31_1: R31.1 U1.B9(GPIO_14)
NetR32_1: R32.1 U1.A10(GPIO_15)
NetR33_1: R33.1 U1.A9(GPIO_16)
NetR34_1: R34.1 U1.B8(GPIO_17)
NetR35_1: R35.1 U1.A8(GPIO_18)
NetR36_1: R36.1 U1.B6(GPIO_19)
NetR37_1: R37.1 U1.B7(GPIO_20)
NetR38_1: R38.1 U1.A7(GPIO_21)
NetR39_1: R39.1 U1.C7(GPIO_22)
NetR40_1: R40.1 U1.C6(GPIO_23)
NetR41_1: R41.1 U1.E1(SDA)
NetR42_1: R42.1 U1.F3(SCL)
NetR73_1: R73.1 U1.L3(SPI_TXD)
NetR74_1: R74.1 U1.L2(SPI_CLKOUT)
NetR75_1: R75.1 U1.K3(SPI_FSSOUT)
NetR76_1: R76.1 U1.K2(SPI_RXD)
NetR79_2: R79.2 U2.E9(PC_WRREQ)
NetR80_2: R80.2 U2.E10(PC_WRDATA)
NetR81_2: R81.2 U2.F9(PC_CLK)
NetR82_2: R82.2 U2.F10(PC_RDRDY_OUT)
NetR83_2: R83.2 U2.G10(PC_RDDATA_OUT)
NetR84_2: R84.2 U2.J7(PC_RDREQ)
NetR85_2: R85.2 U2.K7(PC_RESETN)
NetTP2_1: TP2.1(A) U2.B4(M3_VDD_IP2_OUT)
NetTP3_1: TP3.1(A) U2.A6(ANA_OUT0)
NetTP4_1: TP4.1(A) U2.E1(SDA_AOUT)
NetTP6_1: TP6.1(A) U2.A4(M3_VDD_0P6_OUT)
NetTP7_1: TP7.1(A) U2.B6(ANA_OUT1)
NetTP8_1: TP8.1(A) U2.E2(SCL_AOUT)
NetTP10_1: TP10.1(A) U2.B7(ANA_IN0)
NetTP11_1: TP11.1(A) U2.A7(ANA_IN1)

### Notes on the sheet
- PINT (Programming INTerface chip)
- M3 (Michigan Millimeter Mote)
- M3 ICE: PINT & M3 Chips

### Library data of the parts
C21-C23 = Cap Semi: Capacitor (Semiconductor SIM Model); DistPartNo: 399-7893-1-ND; ManPartNo: C0603C302K5GACTU; Published: 8-Jun-2000; LatestRevisionDate: 29-May-2009; LatestRevisionNote: IPC-7351 Footprint Added.; PackageReference: C1206; Publisher: Altium Limited; PackageDescription: Chip Capacitor
C24 C58-C60 = Cap Semi: as C26 on sheet Power; Published: 8-Jun-2000; LatestRevisionDate: 29-May-2009; LatestRevisionNote: IPC-7351 Footprint Added.; PackageReference: C1206; Publisher: Altium Limited; PackageDescription: Chip Capacitor
P2 P15 = Header 4X2: Header, 4-Pin, Dual row; LatestRevisionDate: 17-Jul-2002; LatestRevisionNote: Re-released for DXP Platform.; Publisher: Altium Limited
P4 = Header 2X2: Header, 2-Pin, Dual row; LatestRevisionDate: 17-Jul-2002; LatestRevisionNote: Re-released for DXP Platform.; Publisher: Altium Limited
P5 = Header 3X2: Header, 3-Pin, Dual row; LatestRevisionDate: 17-Jul-2002; LatestRevisionNote: Re-released for DXP Platform.; Publisher: Altium Limited
P6 = Header 24X2: Header, 24-Pin, Dual row; ManPartNo: 4-103328-0; LatestRevisionDate: 17-Jul-2002; LatestRevisionNote: Re-released for DXP Platform.; Publisher: Altium Limited
R17-R40 R73-R76 R79-R85 = Res Chip: Semiconductor Resistor; DistPartNo: P47GCT-ND; ManPartNo: ERJ-3GEYJ470V; Published: 8-Jun-2000; LatestRevisionDate: 17-Jul-2002; LatestRevisionNote: Re-released for DXP Platform.; PackageReference: AXIAL-0.5; Publisher: Altium Limited; PackageDescription: Axial Device, Thru-Hole; 2 Leads; 0.5 in Pin Spacing
R41 R42 = Res Chip: as R1 on sheet Power; Published: 8-Jun-2000; LatestRevisionDate: 17-Jul-2002; LatestRevisionNote: Re-released for DXP Platform.; PackageReference: AXIAL-0.5; Publisher: Altium Limited; PackageDescription: Axial Device, Thru-Hole; 2 Leads; 0.5 in Pin Spacing
U1 = M3: DistPartNo: 3M5067-ND; ManPartNo: 200-6311-9UN-1900
U2 = PINT: DistPartNo: 3M5066-ND; ManPartNo: 200-6310-9UN-1900

## Sheet M3_Discrete_Interface.SchDoc
size A
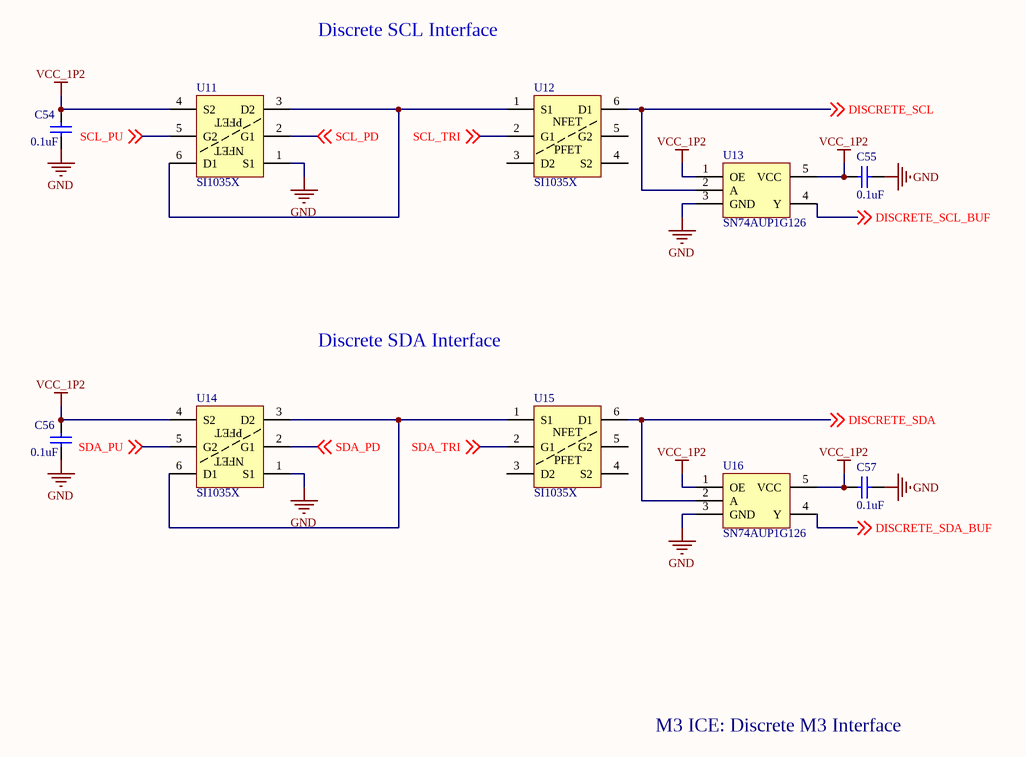
[diagram p3: M3_Discrete_Interface.SchDoc]

### Parts
C54  value 0.1uF  [1608[0603]]  (hidden comment: Cap Semi)
C55  value 0.1uF  [1608[0603]]  (hidden comment: Cap Semi)
C56  value 0.1uF  [1608[0603]]  (hidden comment: Cap Semi)
C57  value 0.1uF  [1608[0603]]  (hidden comment: Cap Semi)
U11  SI1035X  [SC-89-6]
U12  SI1035X  [SC-89-6]
U13  SN74AUP1G126  [SOT-753]
U14  SI1035X  [SC-89-6]
U15  SI1035X  [SC-89-6]
U16  SN74AUP1G126  [SOT-753]

### Nets
GND: C54.1 C55.1 C56.1 C57.1 U11.1(S1) U13.3(GND) U14.1(S1) U16.3(GND)
VCC_1P2: C54.2 C55.2 C56.2 C57.2 U11.4(S2) U13.1(OE) U13.5(VCC) U14.4(S2) U16.1(OE) U16.5(VCC)
DISCRETE_SCL: U12.6(D1) U13.2(A) ; off-sheet DISCRETE_SCL
DISCRETE_SCL_BUF: U13.4(Y) ; off-sheet DISCRETE_SCL_BUF
DISCRETE_SDA: U15.6(D1) U16.2(A) ; off-sheet DISCRETE_SDA
DISCRETE_SDA_BUF: U16.4(Y) ; off-sheet DISCRETE_SDA_BUF
SCL_PD: U11.2(G1) ; off-sheet SCL_PD
SCL_PU: U11.5(G2) ; off-sheet SCL_PU
SCL_TRI: U12.2(G1) ; off-sheet SCL_TRI
SDA_PD: U14.2(G1) ; off-sheet SDA_PD
SDA_PU: U14.5(G2) ; off-sheet SDA_PU
SDA_TRI: U15.2(G1) ; off-sheet SDA_TRI
NetU11_3: U11.3(D2) U11.6(D1) U12.1(S1)
NetU14_3: U14.3(D2) U14.6(D1) U15.1(S1)

Not connected (* = marked no-connect by the designer): U12 3(D2) 4(S2) 5(G2); U15 3(D2) 4(S2) 5(G2)

### Notes on the sheet
- Discrete SCL Interface
- Discrete SDA Interface
- M3 ICE: Discrete M3 Interface
- (in symbol SI1035X) PFET; NFET

### Library data of the parts
C54-C57 = Cap Semi: as C26 on sheet Power; Published: 8-Jun-2000; LatestRevisionDate: 29-May-2009; LatestRevisionNote: IPC-7351 Footprint Added.; PackageReference: C1206; Publisher: Altium Limited; PackageDescription: Chip Capacitor
U11 U12 U14 U15 = SI1035X: Complementary N- and P-Channel 20 V (D-S) MOSFET; DistPartNo: SI1035X-T1-GE3CT-ND; ManPartNo: SI1035X-T1-GE3
U13 U16 = SN74AUP1G126: LOW-POWER SINGLE BUS BUFFER GATE WITH 3-STATE OUTPUT; DistPartNo: 296-18005-1-ND; ManPartNo: SN74AUP1G126DBVR

## Nets that join several sheets
GND: FPGA_IO (16 pins), Power (47 pins), M3_Chip (11 pins), M3_Discrete_Interface (8 pins)
VCC_1P2: FPGA_IO (R9.2), Power (C26.2 P16.1 TP18.1), M3_Discrete_Interface (10 pins)
VCC_GOC: FPGA_IO (C61.1 R12.1 U3.4), Power (5 pins)
VCC_M3_0P6: Power (S7.3 TP21.1), M3_Chip (P2.3)
VCC_M3_1P2: Power (S5.3 TP16.1), M3_Chip (P2.5 P5.6)
VCC_M3_VBATT: Power (S6.3 TP14.1), M3_Chip (P2.7 P5.2 P5.4)
VCC_SOL: Power (TP27.1), M3_Chip (P2.1)
VCC_SYS: FPGA_IO (8 pins), Power (7 pins)
DISCRETE_SCL: M3_Chip (P7.6), M3_Discrete_Interface (U12.6 U13.2)
DISCRETE_SCL_BUF: FPGA_IO (F1.23), M3_Discrete_Interface (U13.4)
DISCRETE_SDA: M3_Chip (P7.3), M3_Discrete_Interface (U15.6 U16.2)
DISCRETE_SDA_BUF: FPGA_IO (F1.19), M3_Discrete_Interface (U16.4)
FPGA_IO_0: FPGA_IO (F1.63), M3_Chip (P6.1)
FPGA_IO_1: FPGA_IO (F1.62), M3_Chip (P6.3)
FPGA_IO_2: FPGA_IO (F1.61), M3_Chip (P6.5)
FPGA_IO_3: FPGA_IO (F1.60), M3_Chip (P6.7)
FPGA_IO_4: FPGA_IO (F1.59), M3_Chip (P6.9)
FPGA_IO_5: FPGA_IO (F1.58), M3_Chip (P6.11)
FPGA_IO_6: FPGA_IO (F1.57), M3_Chip (P6.13)
FPGA_IO_7: FPGA_IO (F1.45), M3_Chip (P6.15)
FPGA_IO_8: FPGA_IO (F1.44), M3_Chip (P6.17)
FPGA_IO_9: FPGA_IO (F1.43), M3_Chip (P6.19)
FPGA_IO_10: FPGA_IO (F1.42), M3_Chip (P6.21)
FPGA_IO_11: FPGA_IO (F1.41), M3_Chip (P6.23)
FPGA_IO_12: FPGA_IO (F1.40), M3_Chip (P6.25)
FPGA_IO_13: FPGA_IO (F1.36), M3_Chip (P6.27)
FPGA_IO_14: FPGA_IO (F1.35), M3_Chip (P6.29)
FPGA_IO_15: FPGA_IO (F1.34), M3_Chip (P6.31)
FPGA_IO_16: FPGA_IO (F1.33), M3_Chip (P6.33)
FPGA_IO_17: FPGA_IO (F1.32), M3_Chip (P6.35)
FPGA_IO_18: FPGA_IO (F1.31), M3_Chip (P6.37)
FPGA_IO_19: FPGA_IO (F1.30), M3_Chip (P6.39)
FPGA_IO_20: FPGA_IO (F1.29), M3_Chip (P6.41)
FPGA_IO_21: FPGA_IO (F1.28), M3_Chip (P6.43)
FPGA_IO_22: FPGA_IO (F1.27), M3_Chip (P6.45)
FPGA_IO_23: FPGA_IO (F1.26), M3_Chip (P6.47)
FPGA_PINT_CLK: FPGA_IO (F1.69), M3_Chip (R81.1)
FPGA_PINT_RDDATA: FPGA_IO (F1.71), M3_Chip (R83.1)
FPGA_PINT_RDRDY: FPGA_IO (F1.70), M3_Chip (R82.1)
FPGA_PINT_RDREQ: FPGA_IO (F1.72), M3_Chip (R84.1)
FPGA_PINT_RESETN: FPGA_IO (F1.73), M3_Chip (R85.1)
FPGA_PINT_WRDATA: FPGA_IO (F1.65), M3_Chip (R80.1)
FPGA_PINT_WRREQ: FPGA_IO (F1.64), M3_Chip (R79.1)
M3_0P6_SW: FPGA_IO (F1.98), Power (U18.4)
M3_1P2_SW: FPGA_IO (F1.97), Power (U8.4)
M3_VBATT_SW: FPGA_IO (F1.96), Power (U17.4)
PMU_SCL: FPGA_IO (F1.95), Power (R58.1 U4.30)
PMU_SDA: FPGA_IO (F1.94), Power (R86.1 U4.31)
SCL_DIG: FPGA_IO (F1.5), M3_Chip (TP5.1 U2.K4)
SCL_PD: FPGA_IO (F1.21), M3_Discrete_Interface (U11.2)
SCL_PU: FPGA_IO (F1.22), M3_Discrete_Interface (U11.5)
SCL_TRI: FPGA_IO (F1.20), M3_Discrete_Interface (U12.2)
SDA_DIG: FPGA_IO (F1.6), M3_Chip (TP9.1 U2.K5)
SDA_PD: FPGA_IO (F1.15), M3_Discrete_Interface (U14.2)
SDA_PU: FPGA_IO (F1.16), M3_Discrete_Interface (U14.5)
SDA_TRI: FPGA_IO (F1.13), M3_Discrete_Interface (U15.2)